# EAGLE design backlight_pwm_adapter (EAGLE 7.7.0)
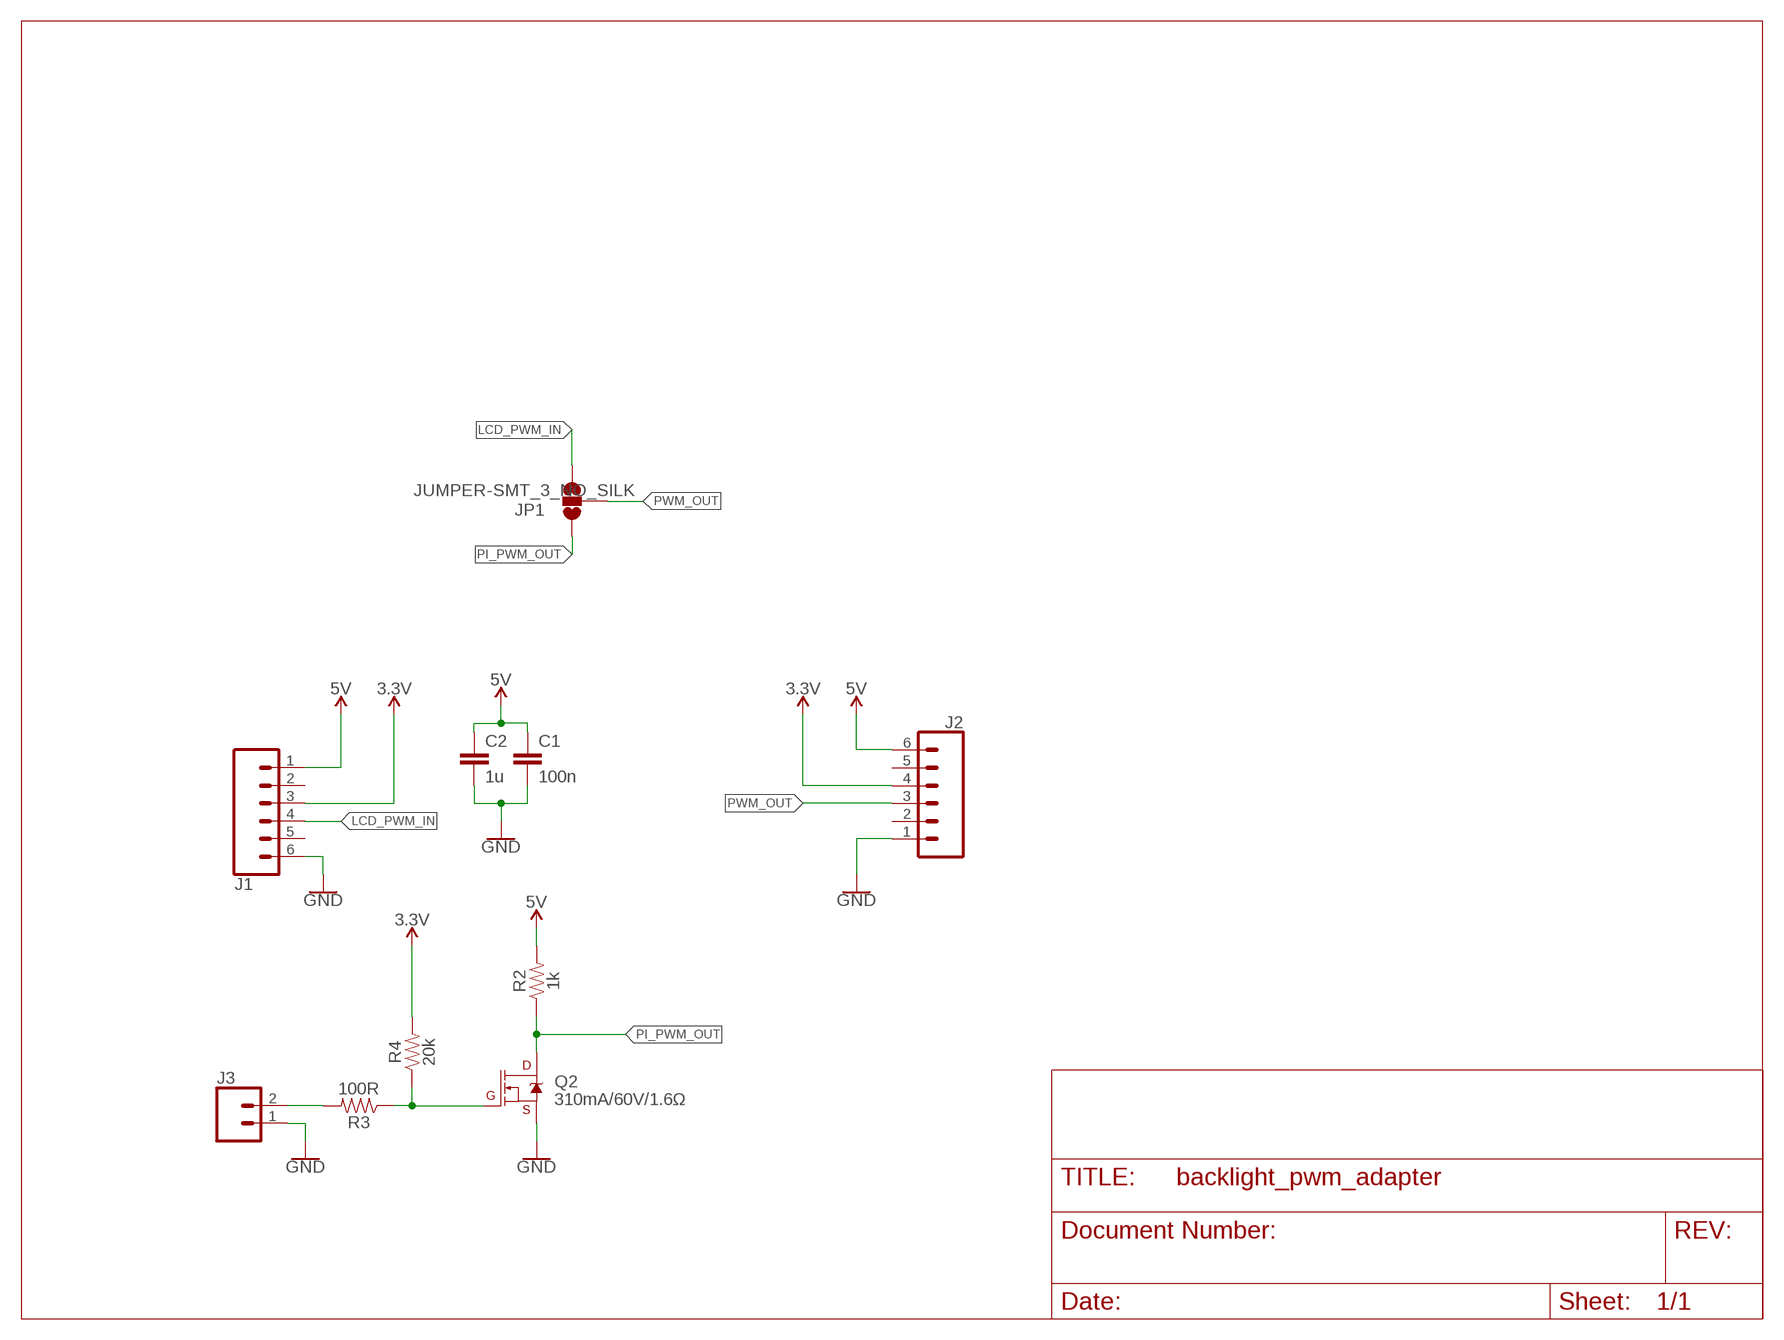
[diagram p0: schematic, sheet 1]

## Parts
C1  100n  CL10B104MB8NNNC  [0603]
C2  1u  CL10A105KA8NNNC  [0603]
J1  CONN_06  [140-506-417-060]
J2  CONN_06  [140-506-417-060]
J3  CONN_02  [1X02]
JP1  JUMPER-SMT_3_NO_SILK  [SMT-JUMPER_3_NO_SILK]
Q2  310mA/60V/1.6Ω  MOSFET-NCH-2N7002PW  [SOT323]
R2  1k  RC0603JR-071KL  [0603]
R3  100R  RC0603JR-07100RL  [0603]
R4  20k  RC0603JR-0720KL  [0603]

## Nets
3.3V: J1.3 J2.4 R4.2
5V: C1.1 C2.1 J1.1 J2.6 R2.2
GND: C1.2 C2.2 J1.6 J2.1 J3.1 Q2.2(S)
LCD_PWM_IN: J1.4 JP1.3
N$1: J3.2 R3.2
N$2: Q2.1(G) R3.1 R4.1
PI_PWM_OUT: JP1.1 Q2.3(D) R2.1
PWM_OUT: J2.3 JP1.2
Unconnected: J1.2 J1.5 J2.2 J2.5

## Library data of the parts
C1 = digital_dash:CL; VOLTAGE: 50V
C2 = digital_dash:CL; VOLTAGE: 25V
J1 J2 = backlight_pwm_adapter:CONN_06: Multi connection point. Often used as Generic Header-pin footprint for 0.1 inch spaced/style header connections On any of the 0.1 inch spaced packages, you can populate with these: Break Away Headers - Straight <https://www.sparkfun.com/products/116> (PRT-00116) Break Away Male Headers - Right Angle <https://www.sparkfun.com/products/553> (PRT-00553) Female Headers <https://www.sparkfun.com/products/115> (PRT-00115) Break Away Headers - Machine Pin <https://www.sparkfun.com/products/117> (PRT-00117) Break Away Female Headers - Swiss Machine Pin <https://www.sparkfun.com/products/743> (PRT-00743) Arduino Stackable Header - 6 Pin <https://www.sparkfun.com/products/9280> (PRT-09280) For SCREWTERMINALS and SPRING TERMINALS visit here: Screw Terimnals on SparkFun.com <https://www.sparkfun.com/search/results?term=Screw+Terminals> (5mm/3.5mm/2.54mm spacing) This device is also useful as a general connection point to wire up your design to another part of your project. Our various solder wires solder well into these plated through hole pads. Hook-Up Wire - Assortment (Stranded, 22 AWG) <https://www.sparkfun.com/products/11375> (PRT-11375) Hook-Up Wire - Assortment (Solid Core, 22 AWG) <https://www.sparkfun.com/products/11367> (PRT-11367) View the entire wire category on our website here <https://www.sparkfun.com/categories/141>
J3 = SparkFun-Connectors:CONN_02: Multi connection point. Often used as Generic Header-pin footprint for 0.1 inch spaced/style header connections On any of the 0.1 inch spaced packages, you can populate with these: Break Away Headers - Straight <https://www.sparkfun.com/products/116> (PRT-00116) Break Away Male Headers - Right Angle <https://www.sparkfun.com/products/553> (PRT-00553) Female Headers <https://www.sparkfun.com/products/115> (PRT-00115) Break Away Headers - Machine Pin <https://www.sparkfun.com/products/117> (PRT-00117) Break Away Female Headers - Swiss Machine Pin <https://www.sparkfun.com/products/743> (PRT-00743) For SCREWTERMINALS and SPRING TERMINALS visit here: Screw Terimnals on SparkFun.com <https://www.sparkfun.com/search/results?term=Screw+Terminals> (5mm/3.5mm/2.54mm spacing) This device is also useful as a general connection point to wire up your design to another part of your project. Our various solder wires solder well into these plated through hole pads. Hook-Up Wire - Assortment (Stranded, 22 AWG) <https://www.sparkfun.com/products/11375> (PRT-11375) Hook-Up Wire - Assortment (Solid Core, 22 AWG) <https://www.sparkfun.com/products/11367> (PRT-11367) View the entire wire category on our website here <https://www.sparkfun.com/categories/141> Special notes: Molex polarized connector foot print use with: PRT-08233 with associated crimp pins and housings. 2.54_SCREWTERM for use with PRT-10571. 3.5mm Screw Terminal footprints for PRT-08084 5mm Screw Terminal footprints for use with PRT-08432
JP1 = SparkFun-Jumpers:JUMPER-SMT_3_NO: Normally open jumper This jumper has three pads in close proximity to each other. Apply solder to close the connection(s).
Q2 = SparkFun-DiscreteSemi:MOSFET-NCH: N-channel MOSFETs Voltage controlled devices that allow control of high current outputs. SparkFun Products: SparkFun OpenScale <https://www.sparkfun.com/products/13261> SparkFun Digital Sandbox <https://www.sparkfun.com/products/12651> SparkFun Monster Moto Shield <https://www.sparkfun.com/products/10182> SparkFun MOSFET Power Controller <https://www.sparkfun.com/products/11214>; PROD_ID: TRANS-11151
R2-R4 = digital_dash:RC0603JR

## Board
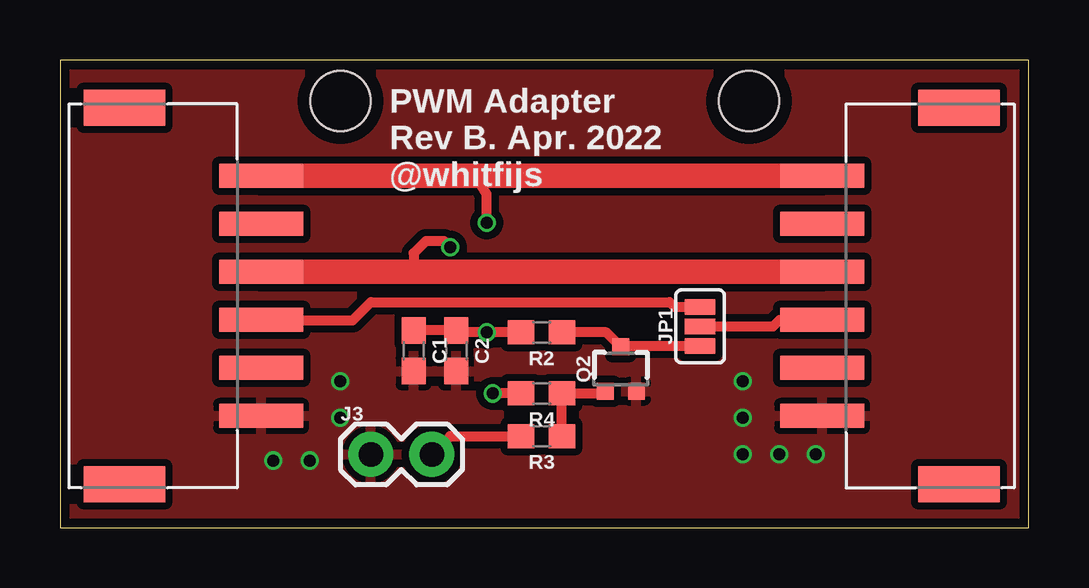
[diagram p1: board, top side]
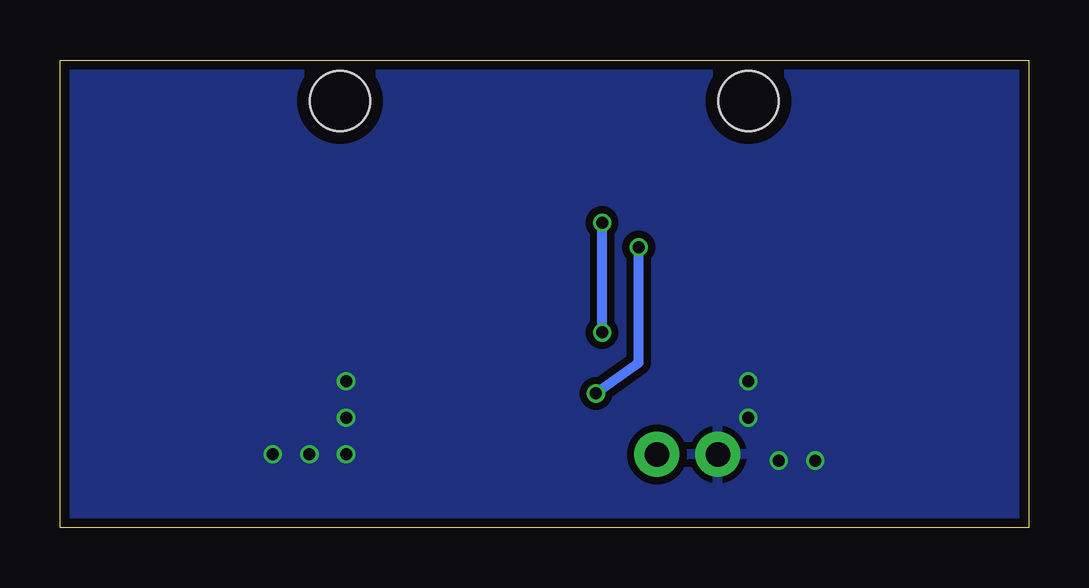
[diagram p2: board, bottom side, seen from below]

Size 40.37 x 19.48 mm. Coordinates in mm from the lower left corner, seen from the top.
Outline: 0,0 40.37,0 40.37,19.48 0,19.48 0,0
Copper layers (1*16): Top 0.035559375mm / dielectric 1.6mm / Bottom 0.035559375mm
Design rules "oshpark-2layer": minimum track width 6mil, minimum drill 10mil, track to track 6mil, track to pad 6mil, pad to pad 6mil, via to via 6mil, smd to smd 6mil, copper to edge 15mil, drill to drill 6mil, minimum pad ring 5mil, minimum via ring 5mil, stop-mask expansion 2.5mil, vias tented up to drill 0mil, thermal gap 10mil
Holes 2.5 mm at 11.68,17.78 28.7,17.78
tRestrict: area 10.4,16.5 to 13,19.1; area 27.4,16.5 to 30,19.1
bRestrict: area 10.4,16.5 to 13,19.1; area 27.4,16.5 to 30,19.1

### Footprints (pad centres in the part's own frame; a part is rotated, then mirrored left to right if it is on the bottom)
0603 = smd 1.1 x 1: 1 -0.85,0; 2 0.85,0
140-506-417-060 = smd 1 x 3.5: 1 5,0; 2 3,0; 3 1,0; 4 -1,0; 5 -3,0; 6 -5,0 | smd 1.5 x 3.4: PAD@0 -7.85,5.7; PAD@1 7.85,5.7
1X02 = drill 1.016 pad 1.88: 1 0,0; 2 2.54,0
SMT-JUMPER_3_NO_SILK = smd 0.635 x 1.27: 1 -0.813,0; 2 0,0; 3 0.813,0
SOT323 = smd 0.7 x 0.7: 1 -0.65,-0.925; 2 0.65,-0.925; 3 0,0.925

### Placement (x,y rotation side)
C1  14.73,7.37 270 top
C2  16.51,7.37 270 top
J1  8.38,9.65 90 top
J2  31.75,9.65 270 top
J3  12.95,3.05 0 top
JP1  26.67,8.38 90 top
Q2  23.37,6.6 0 top
R2  20.07,8.13 180 top
R3  20.07,3.81 180 top
R4  20.07,5.59 180 top

### Tracks (layer width: path | path; a pad name or v marks a point on that pad's centre or on a via)
3.3V  (via drill 0.5)
  Top 0.406: R4.2 v18.03,5.59 | v16.26,11.68 16,11.94 15.24,11.94 14.73,11.43 14.73,10.65
  Top 1.016: J1.3 14.73,10.65 J2.4
  Bottom 0.406: v18.03,5.59 16.26,6.86 v16.26,11.68
5V  (via drill 0.5)
  Top 0.406: R2.2 v17.78,8.13 16.51,8.13 C2.1 C1.1 | v17.78,12.7 17.78,13.89 17.27,14.65
  Top 1.016: J1.1 17.27,14.65 J2.6
  Bottom 0.406: v17.78,8.13 v17.78,12.7
GND  (via drill 0.5)
  other vias: 28.45,6.1 28.45,4.57 28.45,3.05 29.97,3.05 31.5,3.05 11.68,4.57 11.68,6.1 10.41,2.79 8.89,2.79
  pour Top (isolate 0.305): 0,19.56 40.64,19.56 40.64,0 -0.25,0 -0.25,19.56
  pour Bottom (isolate 0.305): 0,19.56 40.64,19.56 40.64,0 -0.25,0 -0.25,19.56
LCD_PWM_IN
  Top 0.406: J1.4 8.4,8.64 12.19,8.64 12.95,9.4 25.4,9.4 25.6,9.2 JP1.3
N$1
  Top 0.406: J3.2 16.26,3.81 R3.2
N$2
  Top 0.406: R3.1 21.01,3.9 20.92,3.99 R4.1 22.72,5.59 Q2.1
PI_PWM_OUT
  Top 0.406: R2.1 22.77,8.13 Q2.3 23.41,7.57 JP1.1
PWM_OUT
  Top 0.406: JP1.2 29.72,8.38 29.99,8.65 J2.3

### Text on the board
tPlace: PWM Adapter / Rev B. Apr. 2022 / @whitfijs